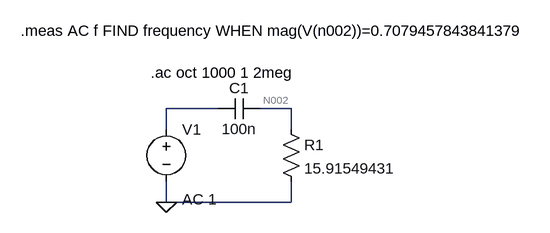
[diagram p0: schematic hpf_1st_ord_100khz_cutoff.asc]
hpf_1st_ord_100khz_cutoff.asc, the LTspice schematic file:
Version 4.1
SHEET 1 880 680
WIRE 144 96 64 96
WIRE 256 96 208 96
WIRE 64 128 64 96
WIRE 256 128 256 96
WIRE 64 240 64 208
WIRE 256 240 256 208
WIRE 256 240 64 240
FLAG 64 240 0
SYMBOL voltage 64 112 R0
WINDOW 3 24 152 Left 2
WINDOW 123 24 124 Left 2
WINDOW 39 0 0 Left 0
SYMATTR Value ""
SYMATTR Value2 AC 1
SYMATTR InstName V1
SYMBOL cap 208 80 R90
WINDOW 0 0 32 VBottom 2
WINDOW 3 32 32 VTop 2
SYMATTR InstName C1
SYMATTR Value 100n
SYMBOL res 240 112 R0
SYMATTR InstName R1
SYMATTR Value 15.91549431
TEXT 40 40 Left 2 !.ac oct 1000 1 2meg
TEXT -160 -24 Left 2 !.meas AC f FIND frequency WHEN mag(V(n002))=0.7079457843841379

The netlist it stands for:
* hpf_1st_ord_100khz_cutoff.asc
V1 N001 0 AC 1
C1 N002 N001 100n
R1 N002 0 15.91549431
.ac oct 1000 1 2meg
.meas AC f FIND frequency WHEN mag(V(n002))=0.7079457843841379
.backanno
.end